# Altium schematic sheet Sheet1.SchDoc
size A; SheetNumber: 1; SheetTotal: 1
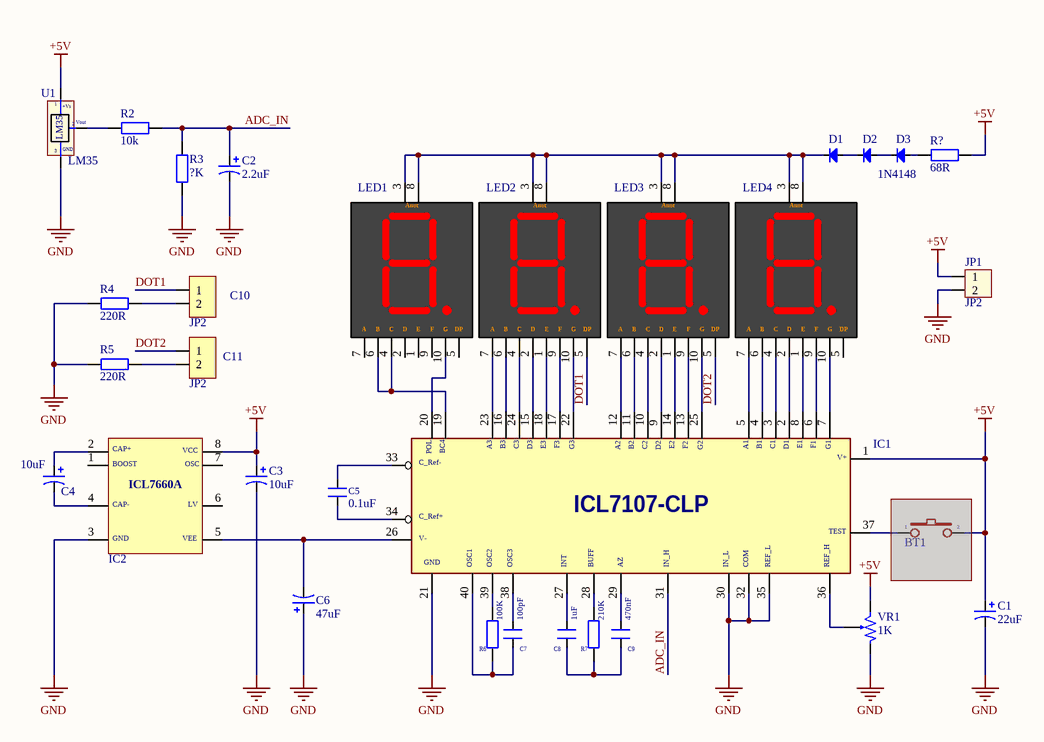
[diagram p0: Sheet1.SchDoc]

## Parts
BT1  BUTTON1  [SW4]  (value not drawn)  (masked out: inside a compile mask, not in the netlist)
C1  22uF  [C8MM]
C2  2.2uF  [C5mm]
C3  10uF  [C5mm]
C4  10uF  [C5mm]
C5  0.1uF  [CN-SMD-0805]
C6  47uF  [C5mm]
C7  100pF  [CN2-R]
C8  1uF  [CN2-R]
C9  470nF  [CN2-R]
C10  JP2  [JP2-CLOSED]
C11  JP2  [JP2-CLOSED]
D1  1N4148  [DIODE/POW/1A]  (value not drawn)
D2  1N4148  [DIODE/POW/1A]  (value not drawn)
D3  1N4148  [DIODE/POW/1A]
IC1  ICL7107  [DIP-40]  (value not drawn)
IC2  ICL7660  [DIP-8]  (value not drawn)
JP1  JP2  [CON2]
LED1  5611BS  [7SEG-0.56"]  (value not drawn)
LED2  5611BS  [7SEG-0.56"]  (value not drawn)
LED3  5611BS  [7SEG-0.56"]  (value not drawn)
LED4  5611BS  [7SEG-0.56"]  (value not drawn)
R2  10k  [RES-1/4W]
R3  ?K  [RES-1/4W]
R4  220R  [RES-1/4W]
R5  220R  [RES-1/4W]
R6  100K  [RES-1/4W]
R7  210K  [RES-1/4W]
R?  68R  [RES-1/4W]
U1  LM35  [QTO-92]
VR1  1K  [VR2]

## Nets
+5V: C1.1 C3.1 IC1.1 IC2.8 JP1.1 R?.2 U1.1(+Vs) VR1.3
GND: C1.2 C2.2 C3.2 C6.1 IC1.21 IC1.30 IC1.32 IC1.35 IC2.3 JP1.2 R3.1 R4.2 R5.2 U1.3(-) VR1.1
ADC_IN: C2.1 IC1.31 R2.2 R3.2
DOT1: C10.1 LED2.5
DOT2: C11.1 LED3.5
NetC4_1: C4.1 IC2.2
NetC4_2: C4.2 IC2.4
NetC5_1: C5.1 IC1.34
NetC5_2: C5.2 IC1.33
NetC6_2: C6.2 IC1.26 IC2.5
NetC7_1: C7.1 IC1.40 R6.1
NetC7_2: C7.2 IC1.38
NetC8_1: C8.1 C9.1 R7.1
NetC8_2: C8.2 IC1.27
NetC9_2: C9.2 IC1.29
NetC10_2: C10.2 R4.1
NetC11_2: C11.2 R5.1
NetD1_A: D1.A D2.K
NetD1_K: D1.K LED1.3 LED1.8 LED2.3 LED2.8 LED3.3 LED3.8 LED4.3 LED4.8
NetD2_A: D2.A D3.K
NetD3_A: D3.A R?.1
NetIC1_2: IC1.2 LED4.2
NetIC1_3: IC1.3 LED4.4
NetIC1_4: IC1.4 LED4.6
NetIC1_5: IC1.5 LED4.7
NetIC1_6: IC1.6 LED4.9
NetIC1_7: IC1.7 LED4.10
NetIC1_8: IC1.8 LED4.1
NetIC1_9: IC1.9 LED3.2
NetIC1_10: IC1.10 LED3.4
NetIC1_11: IC1.11 LED3.6
NetIC1_12: IC1.12 LED3.7
NetIC1_13: IC1.13 LED3.9
NetIC1_14: IC1.14 LED3.1
NetIC1_15: IC1.15 LED2.2
NetIC1_16: IC1.16 LED2.6
NetIC1_17: IC1.17 LED2.9
NetIC1_18: IC1.18 LED2.1
NetIC1_19: IC1.19 LED1.4 LED1.6
NetIC1_20: IC1.20 LED1.10
NetIC1_22: IC1.22 LED2.10
NetIC1_23: IC1.23 LED2.7
NetIC1_24: IC1.24 LED2.4
NetIC1_25: IC1.25 LED3.10
NetIC1_28: IC1.28 R7.2
NetIC1_36: IC1.36 VR1.2
NetIC1_39: IC1.39 R6.2
NetR2_1: R2.1 U1.2(Vout)

Not connected (* = marked no-connect by the designer): IC1 37; IC2 1 6 7; LED1 1 2 5 7 9; LED4 5

## Notes on the sheet
- (in symbol 5611BS) Anot; A; B; C; D; E; F; G; DP
- (in symbol ICL7107) POL; BC4; A3; B3; C3; D3; E3; F3; G3; A2; B2; C2; D2; E2; F2; G2; A1; B1; C1; D1; E1; F1; G1; C_Ref-; V+; C_Ref+; ICL7107-CLP; TEST; V-; GND; OSC1; OSC2; OSC3; INT; BUFF; AZ; IN_H; IN_L; COM; REF_L; REF_H
- (in symbol ICL7660) CAP+; VCC; BOOST; OSC; ICL7660A; CAP-; LV; GND; VEE
- (in symbol LM35) GND

## Library data of the parts
BT1 = BUTTON1: Value: 1N4007
C1-C4 C6 = CAP-Radial: Published: 8-Jun-2000; LatestRevisionDate: 17-Jul-2002; LatestRevisionNote: Re-released for DXP Platform.; PackageReference: POLAR0.8; Publisher: Altium Limited; value: ?
C5 = CAP SMD: Value: 0,1uF/300V; Designed by: VanDungEvn
C7-C9 = CAP-gom: Value: 33pF
C10 C11 = JP2: WR-PHD 2.54 mm Angled Socket Header; Manufacturer: W¨¹rth Elektronik eiSos GmbH; partNo: 613002143121; ComponentLink1 Description: Manufacturer; ComponentLink2 Description: Datasheet; NoPins: 02; Created Date: 29 March 2013; ComponentLink1URL: http://www.we-online.com; ComponentLink2URL: http://katalog.we-online.de/em/datasheet/6130xx143121.pdf; Created by: Karrer Zheng
D1-D3 = Diode-1N4148: Default Diode; pin to pad: A>1 K>2; Code - JEDEC: DO-214-AB; Value: 1N5007; Published: 8-Jun-2000; Revision: July-2002: Re-released for DXP Platform.; Publisher: Altium Limited
IC1 = ICL7107: 31/2 Digit, LCD/LED Display, A/D Converters
JP1 = Con2: Connector 2; Value: Connector 2
R2-R7 R? = R: Resistor R1/4W
U1 = LM35: Teminal; Value: LM35
VR1 = VR: Var Resistor RM065; RM065-104: 10K; RM065-503: 5K; RM065-103: 1K